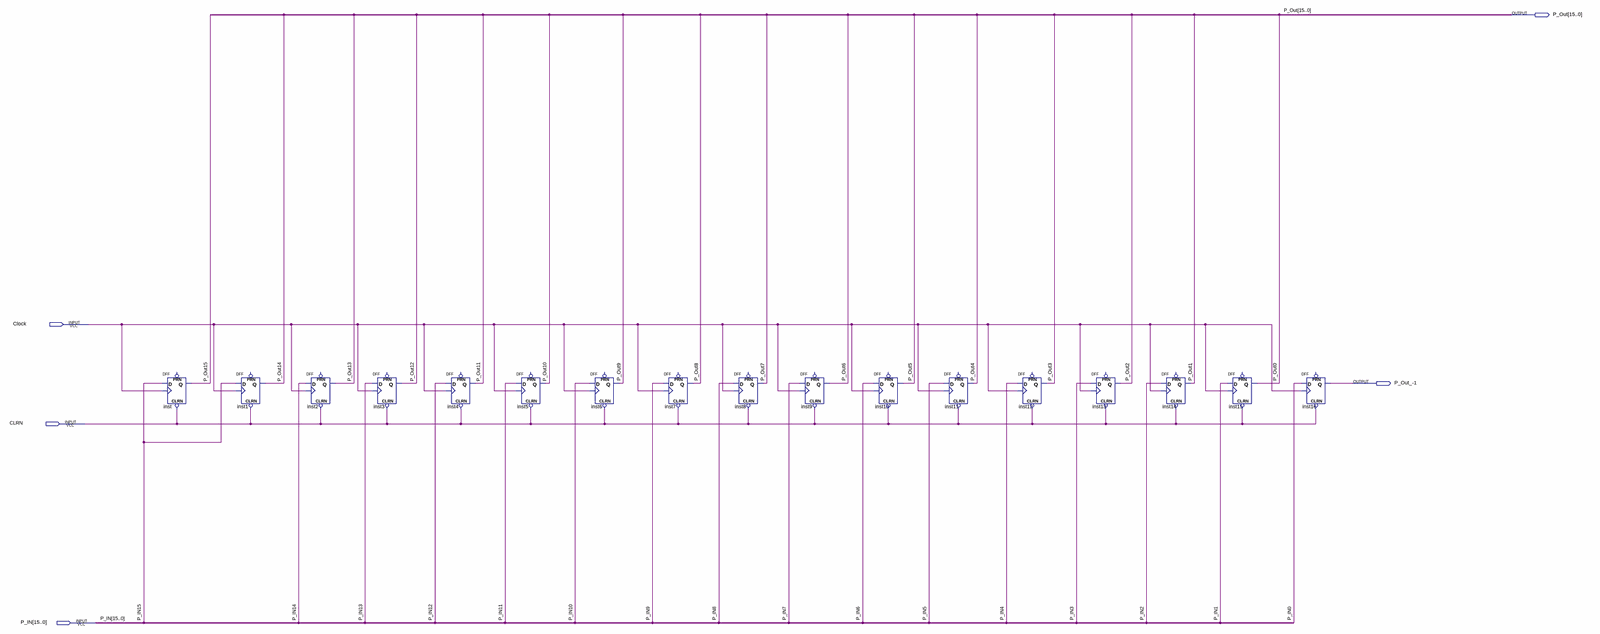
[diagram p0: schematic sheet, whole]
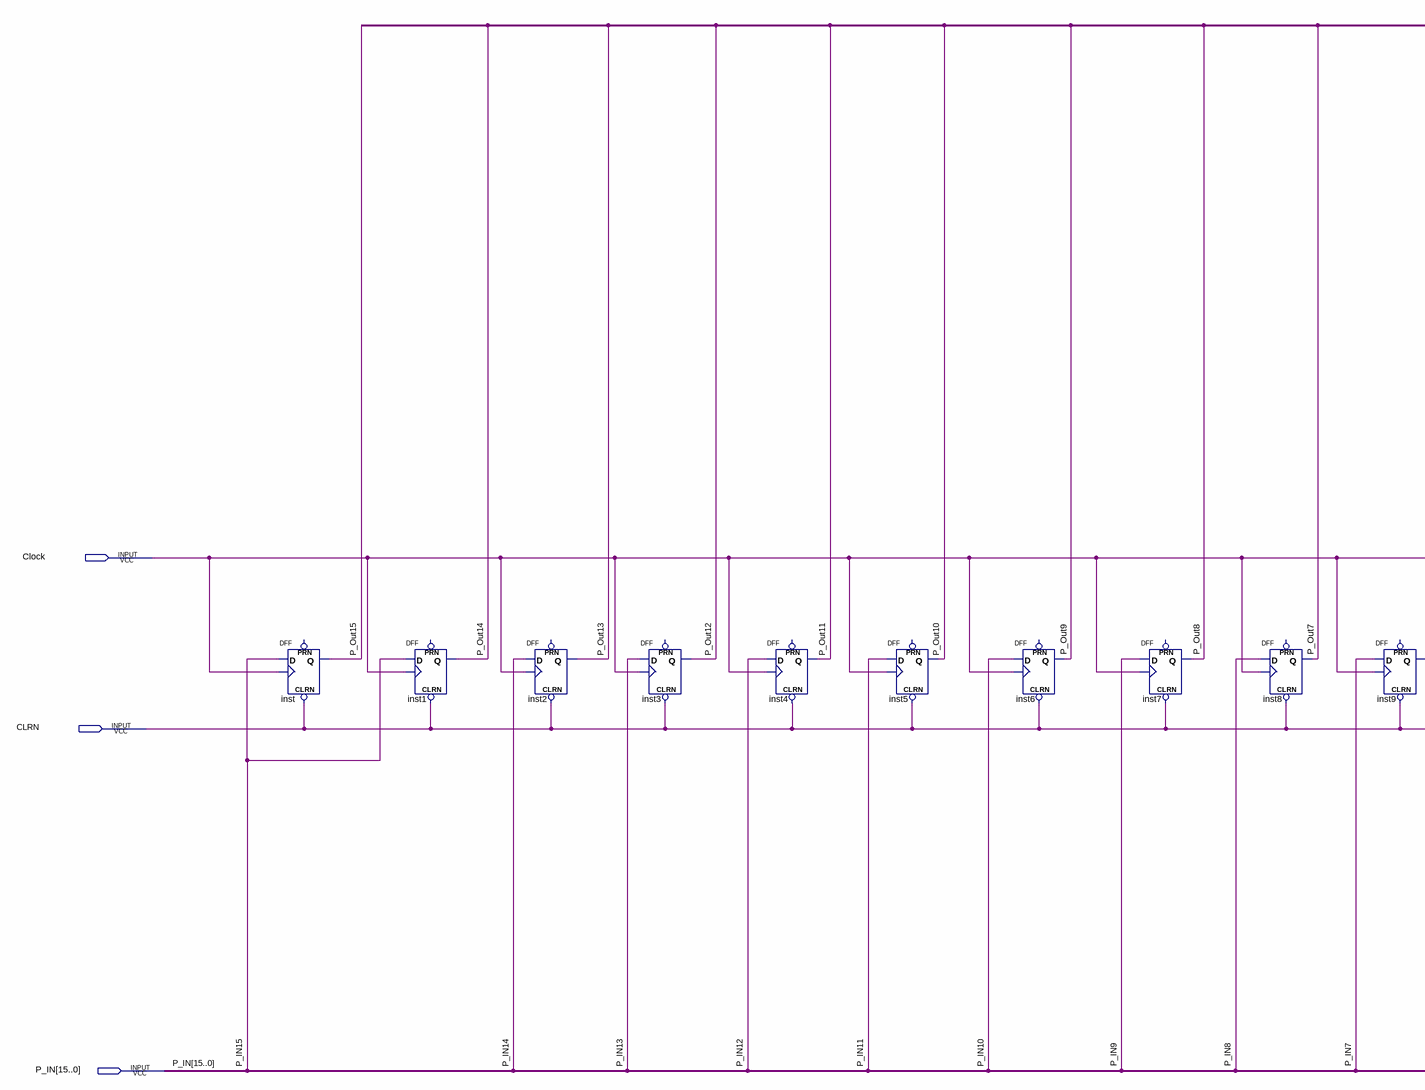
[diagram p1: schematic sheet, left part]
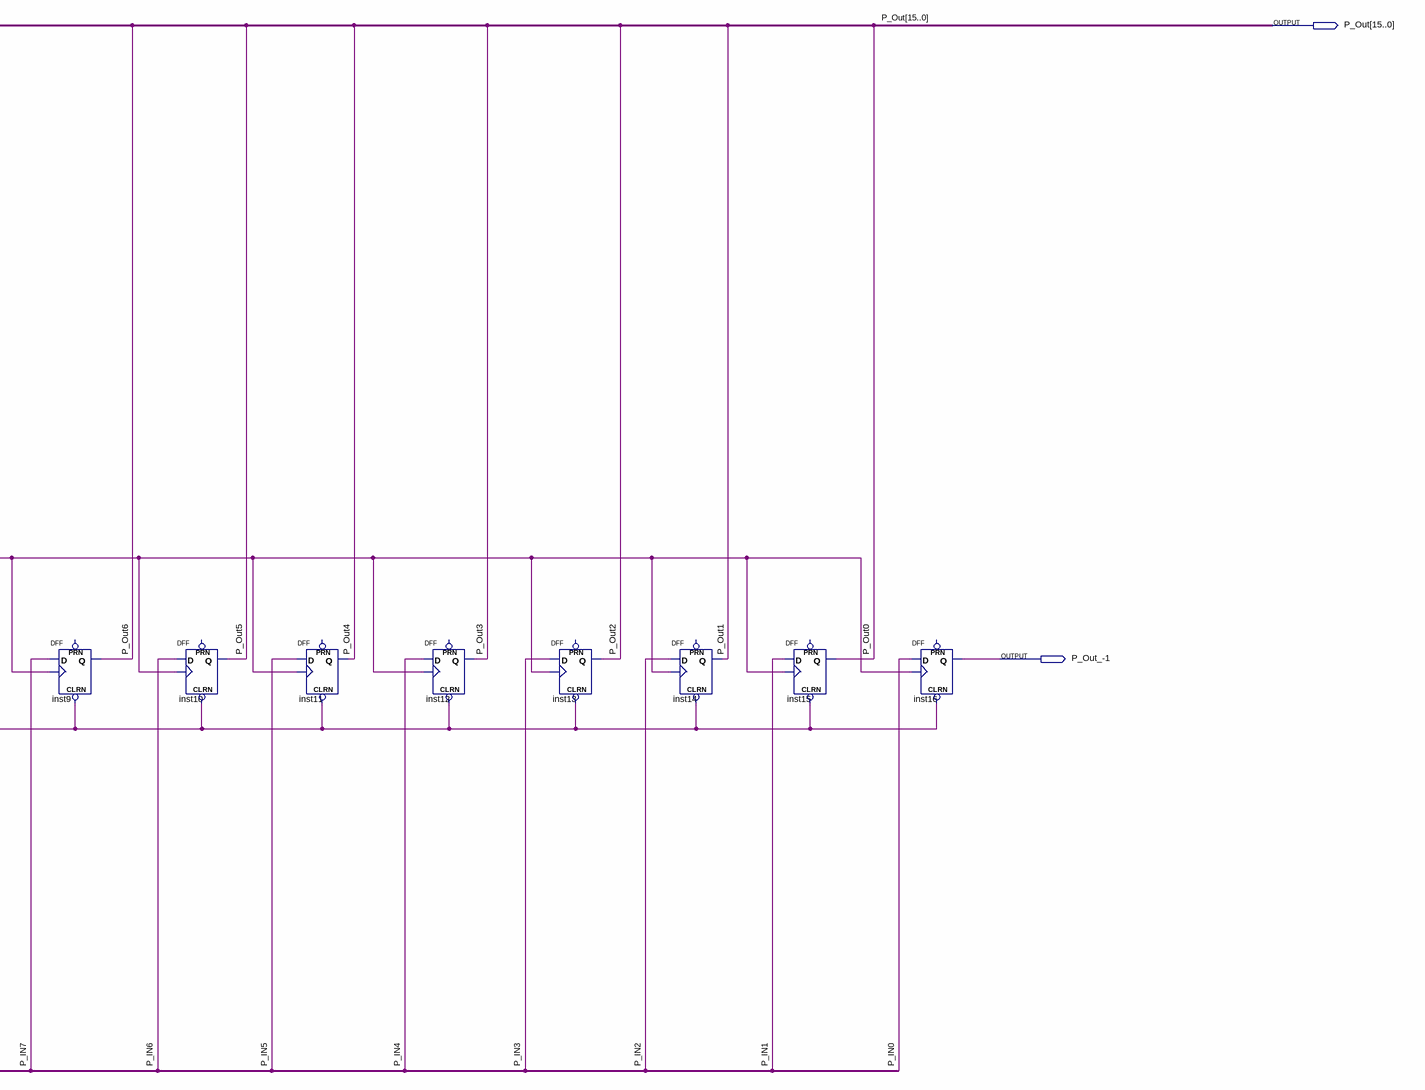
[diagram p2: schematic sheet, right part]
// Quartus schematic 17b_Parallel_Shift.bdf as structural Verilog: 17 symbols, 5 pins
module \17b_Parallel_Shift  (
  input  Clock,
  input  CLRN,
  input  [15:0] P_IN,
  output [15:0] P_Out,
  output \P_Out_-1 
);

  DFF inst (.CLRN(CLRN), .CLK(Clock), .D(P_IN[15]), .Q(P_Out[15]));  // open: PRN
  DFF inst1 (.CLRN(CLRN), .CLK(Clock), .D(P_IN[15]), .Q(P_Out[14]));  // open: PRN
  DFF inst2 (.CLRN(CLRN), .CLK(Clock), .D(P_IN[14]), .Q(P_Out[13]));  // open: PRN
  DFF inst3 (.CLRN(CLRN), .CLK(Clock), .D(P_IN[13]), .Q(P_Out[12]));  // open: PRN
  DFF inst4 (.CLRN(CLRN), .CLK(Clock), .D(P_IN[12]), .Q(P_Out[11]));  // open: PRN
  DFF inst5 (.CLRN(CLRN), .CLK(Clock), .D(P_IN[11]), .Q(P_Out[10]));  // open: PRN
  DFF inst6 (.CLRN(CLRN), .CLK(Clock), .D(P_IN[10]), .Q(P_Out[9]));  // open: PRN
  DFF inst7 (.CLRN(CLRN), .CLK(Clock), .D(P_IN[9]), .Q(P_Out[8]));  // open: PRN
  DFF inst8 (.CLRN(CLRN), .CLK(Clock), .D(P_IN[8]), .Q(P_Out[7]));  // open: PRN
  DFF inst9 (.CLRN(CLRN), .CLK(Clock), .D(P_IN[7]), .Q(P_Out[6]));  // open: PRN
  DFF inst10 (.CLRN(CLRN), .CLK(Clock), .D(P_IN[6]), .Q(P_Out[5]));  // open: PRN
  DFF inst11 (.CLRN(CLRN), .CLK(Clock), .D(P_IN[5]), .Q(P_Out[4]));  // open: PRN
  DFF inst12 (.CLRN(CLRN), .CLK(Clock), .D(P_IN[4]), .Q(P_Out[3]));  // open: PRN
  DFF inst13 (.CLRN(CLRN), .CLK(Clock), .D(P_IN[3]), .Q(P_Out[2]));  // open: PRN
  DFF inst14 (.CLRN(CLRN), .CLK(Clock), .D(P_IN[2]), .Q(P_Out[1]));  // open: PRN
  DFF inst15 (.CLRN(CLRN), .CLK(Clock), .D(P_IN[1]), .Q(P_Out[0]));  // open: PRN
  DFF inst16 (.CLRN(CLRN), .CLK(Clock), .D(P_IN[0]), .Q(\P_Out_-1 ));  // open: PRN
endmodule
